# EAGLE design LeftConnector (EAGLE 9.6.2)
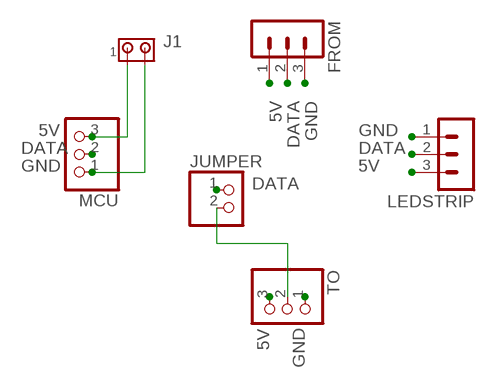
[diagram p0: schematic, sheet 1]

## Parts
FROM  MA03-1  [MA03-1]
J1  MTA02-156  [1X2MTA]
JUMPER  PINHD-1X2  [1X02]
LEDSTRIP  MA03-1  [MA03-1]
MCU  PINHD-1X3/90  [1X03/90]
TO  PINHD-1X3/90  [1X03/90]

## Nets
5V: FROM.1 J1.1 LEDSTRIP.3 MCU.3 TO.3
DATA: FROM.2 JUMPER.1 LEDSTRIP.2 MCU.2
GND: FROM.3 J1.2 LEDSTRIP.1 MCU.1 TO.1
N$1: JUMPER.2 TO.2

## Library data of the parts
FROM LEDSTRIP = con-lstb:MA03-1: PIN HEADER; OC_FARNELL: unknown; OC_NEWARK: unknown
J1 = con-amp:MTA02-156: AMP connector
JUMPER = pinhead:PINHD-1X2: PIN HEADER
MCU TO = pinhead:PINHD-1X3: PIN HEADER

## Board
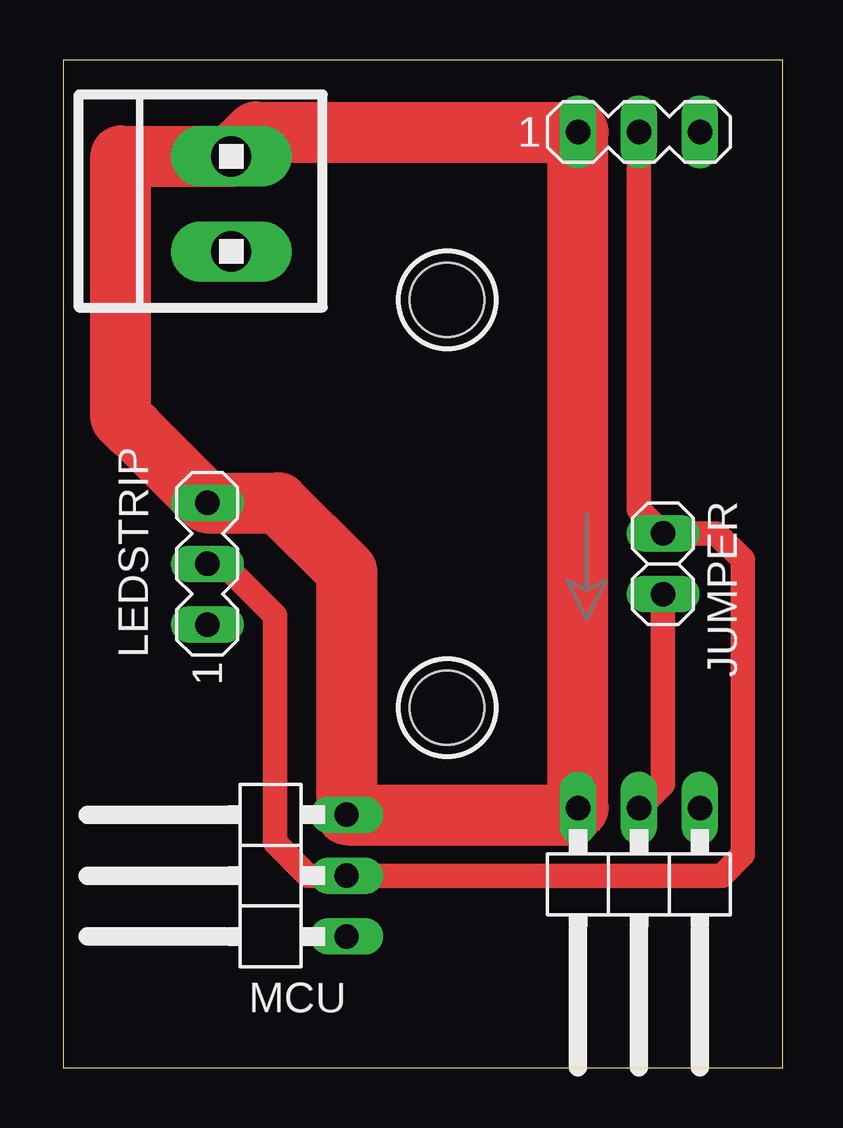
[diagram p1: board, top side]
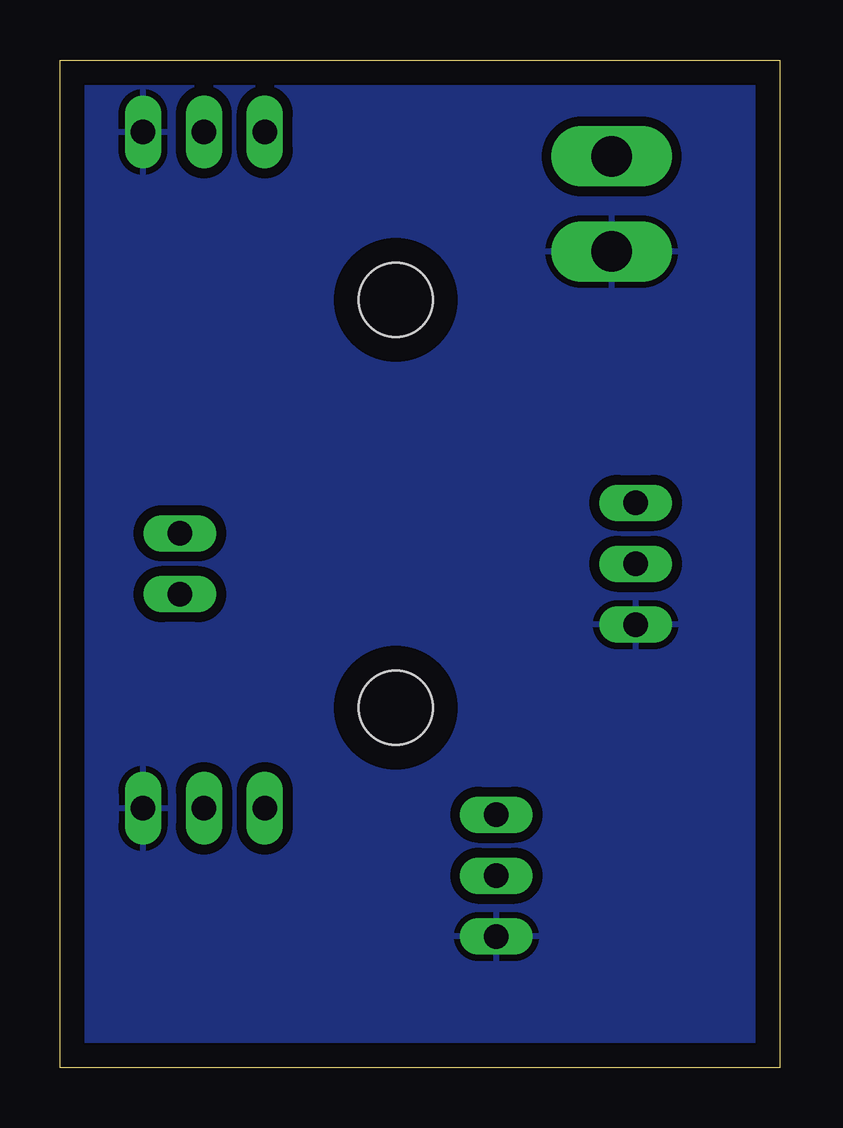
[diagram p2: board, bottom side, seen from below]

Size 30 x 42 mm. Coordinates in mm from the lower left corner, seen from the top.
Outline: 0,0 30,0 30,42 0,42 0,0
Copper layers (1*16): Top 0.035mm / dielectric 1.5mm / Bottom 0.035mm
Design rules "ACES_THT": minimum track width 18mil, minimum drill 0.35mm, track to track 10mil, track to pad 10mil, pad to pad 10mil, via to via 10mil, smd to smd 6mil, copper to edge 40mil, drill to drill 6mil, minimum pad ring 10mil, minimum via ring 8mil, stop-mask expansion 4mil, vias tented up to drill 0mil, thermal gap 10mil

### Footprints (pad centres in the part's own frame; a part is rotated, then mirrored left to right if it is on the bottom)
MA03-1 = drill 1.016 long: 1 -2.54,0; 2 0,0; 3 2.54,0
1X2MTA = drill 1.676 long: 1 1.981,0; 2 -1.981,0
1X02 = drill 1.016 long: 1 -1.27,0; 2 1.27,0
1X03/90 = drill 1.016 long: 1 -2.54,-3.81; 2 0,-3.81; 3 2.54,-3.81
MOUNTINGHOLE_3.2MM_PLATEDTHIN = hole 3.1: 0,0

### Placement (x,y rotation side)
FROM  24,39 0 top
J1  7,36 90 top
JUMPER  25,21 270 top
LEDSTRIP  6,21 90 top
MCU  8,8 90 top
TO  24,7 180 top
U$1  [MOUNTINGHOLE_3.2MM_PLATEDTHIN]  16,32 0 top
U$2  [MOUNTINGHOLE_3.2MM_PLATEDTHIN]  16,15 0 top

### Tracks (layer width: path | path; a pad name or v marks a point on that pad's centre or on a via)
5V
  Top 2.54: J1.1 8.02,39 FROM.1 TO.3 21.19,10.54 MCU.3 11.81,20.69 8.96,23.54 LEDSTRIP.3 2.94,26.6 2.9,26.6 2.4,27.1 2.4,38 6.98,38 J1.1
DATA
  Top 1.016: LEDSTRIP.2 6.67,21 8.83,18.84 8.83,9.38 10.21,8 MCU.2 27.44,8 28.33,8.89 28.33,21.17 27.23,22.27 JUMPER.1 24,23.27 FROM.2
GND
  pour Bottom (isolate 0.406): 0,42 30,42 30,0 0,0
N$1
  Top 1.016: JUMPER.2 25,11.81 TO.2

### Text on the board
tDocu: 5V | GND | Left Connector | 5V | Data | GND | 5V | Data | GND
bDocu: Ping pong LED matrix v1.0 / Xander Chin